# EAGLE design Driver-H-DC_V2_0 (EAGLE 5.11)
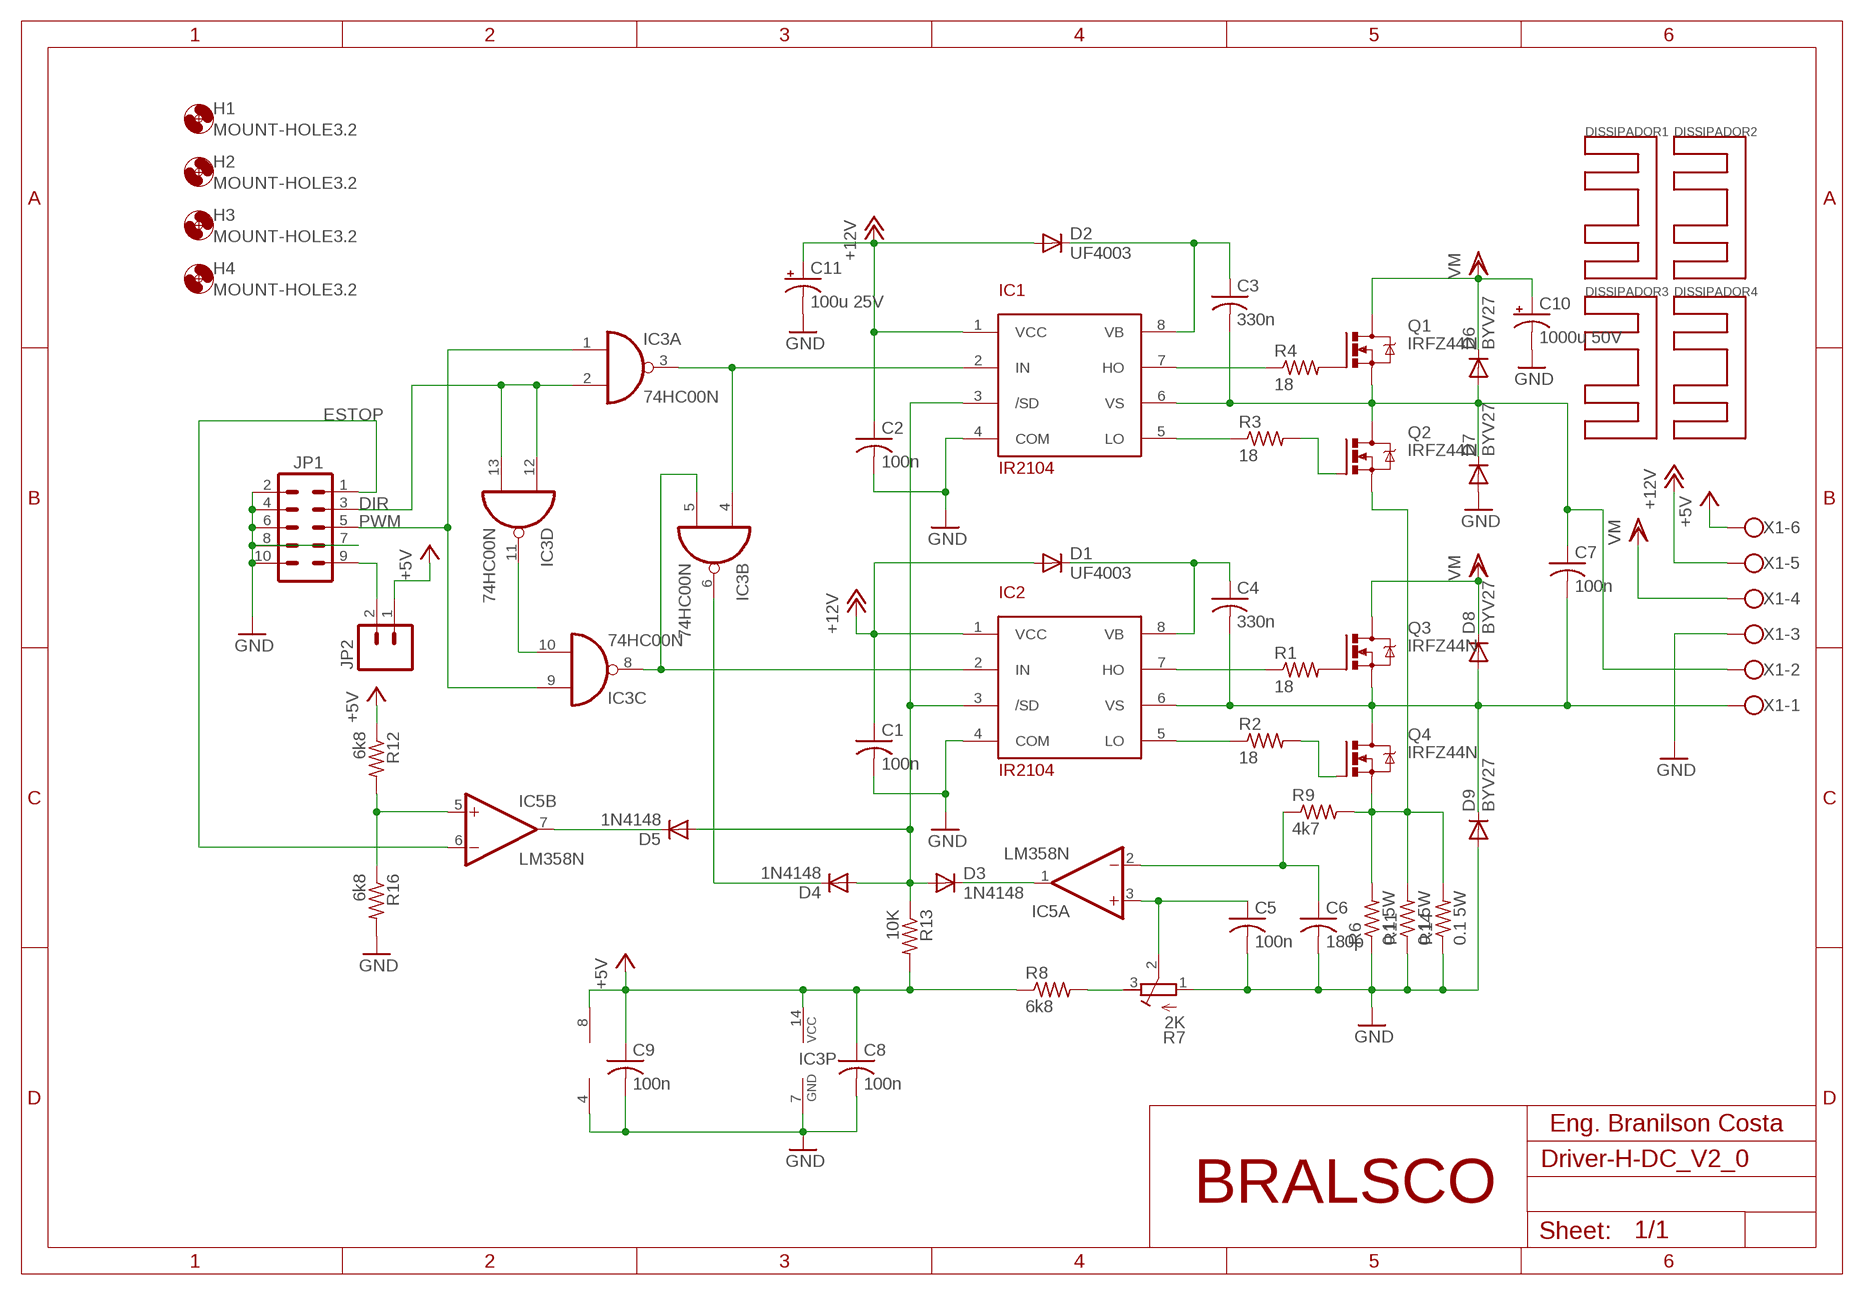
[diagram p0: schematic, sheet 1]

## Parts
C1  100n  C-US075-032X103  [C075-032X103]
C2  100n  C-US075-032X103  [C075-032X103]
C3  330n  C-US050-024X044  [C050-024X044]
C4  330n  C-US050-024X044  [C050-024X044]
C5  100n  C-US075-032X103  [C075-032X103]
C6  180p  C-US075-032X103  [C075-032X103]
C7  100n  C-US050-024X044  [C050-024X044]
C8  100n  C-US050-024X044  [C050-024X044]
C9  100n  C-US075-032X103  [C075-032X103]
C10  1000u 50V  CPOL-USE7.5-16  [E7,5-16]
C11  100u 25V  CPOL-USE5-8.5  [E5-8,5]
D1  UF4003  [DO41-10]
D2  UF4003  [DO41-10]
D3  1N4148  1N4148DO35-10  [DO35-10]
D4  1N4148  1N4148DO35-10  [DO35-10]
D5  1N4148  1N4148DO35-10  [DO35-10]
D6  BYV27  [SOD57-10]
D7  BYV27  [SOD57-10]
D8  BYV27  [SOD57-10]
D9  BYV27  [SOD57-10]
DISSIPADOR1  D_TO220_ALET  [DTO220ALET]
DISSIPADOR2  D_TO220_ALET  [DTO220ALET]
DISSIPADOR3  D_TO220_ALET  [DTO220ALET]
DISSIPADOR4  D_TO220_ALET  [DTO220ALET]
H1  MOUNT-HOLE3.2  [3,2]
H2  MOUNT-HOLE3.2  [3,2]
H3  MOUNT-HOLE3.2  [3,2]
H4  MOUNT-HOLE3.2  [3,2]
IC1  IR2104  [DIL08]
IC2  IR2104  [DIL08]
IC3  74HC00N  [DIL14]
IC5  LM358N  [DIL08]
JP1  M05X2SHD  [2X5-SHROUDED]
JP2  M02  [1X02_LONGPADS]
Q1  IRFZ44N  IRF540  [TO220BV]
Q2  IRFZ44N  IRF540  [TO220BV]
Q3  IRFZ44N  IRF540  [TO220BV]
Q4  IRFZ44N  IRF540  [TO220BV]
R1  18  R-US_0207/10  [0207/10]
R2  18  R-US_0207/10  [0207/10]
R3  18  R-US_0207/10  [0207/10]
R4  18  R-US_0207/10  [0207/10]
R6  0.1 5W  R-US_0617/17  [0617/17]
R7  2K  R-TRIMM3339P  [RTRIM3339P]
R8  6k8  R-US_0207/10  [0207/10]
R9  4k7  R-US_0207/10  [0207/10]
R11  0.1 5W  R-US_0617/17  [0617/17]
R12  6k8  R-US_0207/10  [0207/10]
R13  10K  R-US_0207/10  [0207/10]
R14  0.1 5W  R-US_0617/17  [0617/17]
R16  6k8  R-US_0207/10  [0207/10]
X1  W237-136  [W237-136]

## Nets
+5V: C8.1 C9.1 IC3.14(P:VCC) IC5.8(P:V+) JP2.1 R8.1 R12.1 R13.2 X1.6
+12V: C1.1 C2.1 C11.+ D1.A D2.A IC1.1(VCC) IC2.1(VCC) X1.5
DIR: IC3.2(A:I1) IC3.12(D:I0) IC3.13(D:I1) JP1.3
ESTOP: IC5.6(B:-IN) JP1.1
GND: C1.2 C2.2 C5.2 C6.2 C8.2 C9.2 C10.- C11.- D7.A D9.A IC1.4(COM) IC2.4(COM) IC3.7(P:GND) IC5.4(P:V-) JP1.2 JP1.4 JP1.6 JP1.7 JP1.8 JP1.10 R6.1 R7.1(E) R11.1 R14.1 R16.2 X1.3
N$1: C4.1 D1.C IC2.8(VB)
N$2: C4.2 C7.2 D8.A D9.C IC2.6(VS) Q3.S Q4.D X1.1
N$3: IC1.2(IN) IC3.3(A:O) IC3.4(B:I0)
N$4: IC2.7(HO) R1.1
N$5: IC1.5(LO) R3.1
N$6: Q3.G R1.2
N$7: IC2.5(LO) R2.1
N$8: Q4.G R2.2
N$9: C3.1 D2.C IC1.8(VB)
N$10: Q2.G R3.2
N$11: IC1.7(HO) R4.1
N$12: Q1.G R4.2
N$13: C3.2 C7.1 D6.A D7.C IC1.6(VS) Q1.S Q2.D X1.2
N$14: D3.A D4.A D5.A IC1.3(/SD) IC2.3(/SD) R13.1
N$16: IC3.10(C:I1) IC3.11(D:O)
N$17: Q2.S Q4.S R6.2 R9.2 R11.2 R14.2
N$18: D3.C IC5.1(A:OUT)
N$19: C5.1 IC5.3(A:+IN) R7.2(S)
N$20: R7.3(A) R8.2
N$21: C6.1 IC5.2(A:-IN) R9.1
N$22: D4.C IC3.6(B:O)
N$23: IC2.2(IN) IC3.5(B:I1) IC3.8(C:O)
N$24: JP1.9 JP2.2
N$25: D5.C IC5.7(B:OUT)
N$28: IC5.5(B:+IN) R12.2 R16.1
PWM: IC3.1(A:I0) IC3.9(C:I0) JP1.5
VDD: C10.+ D6.C D8.C Q1.D Q3.D X1.4 ; supply symbol labelled VM

## Notes on the sheet
- Eng. Branilson Costa
- BRALSCO

## Library data of the parts
C1 C2 C5 C6 C9 = rcl:C-US: CAPACITOR, American symbol
C3 C4 C7 C8 = resistor:C-US: CAPACITOR, American symbol
C10 C11 = rcl:CPOL-US: POLARIZED CAPACITOR, American symbol
D1 D2 = diode:UF4003: DIODE ultrafast recovery diode, 200 V rectifier
D3-D5 = diode:1N4148: DIODE high speed (Philips)
D6-D9 = diode:BYV27: DIODE ultra fast
DISSIPADOR1-DISSIPADOR4 = BL:D_TO220_ALET: Dissipador aletado para componentes em encapsulamento TO220 Dimenssões: 28 x 16mm Grid: 0,7"
H1-H4 = holes:MOUNT-HOLE: MOUNTING HOLE with drill center marker
IC1 IC2 = BL:IR2104
IC3 = 74xx-eu:74*00: Quad 2-input NAND gate
IC5 = linear:LM358: OP AMP also LM158; LM258; LM2904 Source: http://cache.national.com/ds/LM/LM158.pdf
JP1 = SparkFun:M05X2: Header 5x2 Standard 10-pin dual row 0.1" header. Commonly used with AVR-ISP. Use with Spark Fun Electronics SKU: PRT-00778
JP2 = SparkFun:M02: Header 2 Standard 2-pin 0.1" header. Use with straight break away headers (SKU : PRT-00116), right angle break away headers (PRT-00553), swiss pins (PRT-00743), machine pins (PRT-00117), and female headers (PRT-00115). Molex polarized connector foot print use with SKU : PRT-08233 with associated crimp pins and housings.
Q1-Q4 = transistor-power:IRF540: HEXFET Power MOSFET
R1-R4 R6 R8 R9 R11-R14 R16 = resistor:R-US_: RESISTOR, American symbol
R7 = resistor:R-TRIMM: Trimm resistor
X1 = con-wago-500:W237-136: WAGO SCREW CLAMP; MPN: 237-136; OC_FARNELL: unknown; OC_NEWARK: 84K9151

## Board
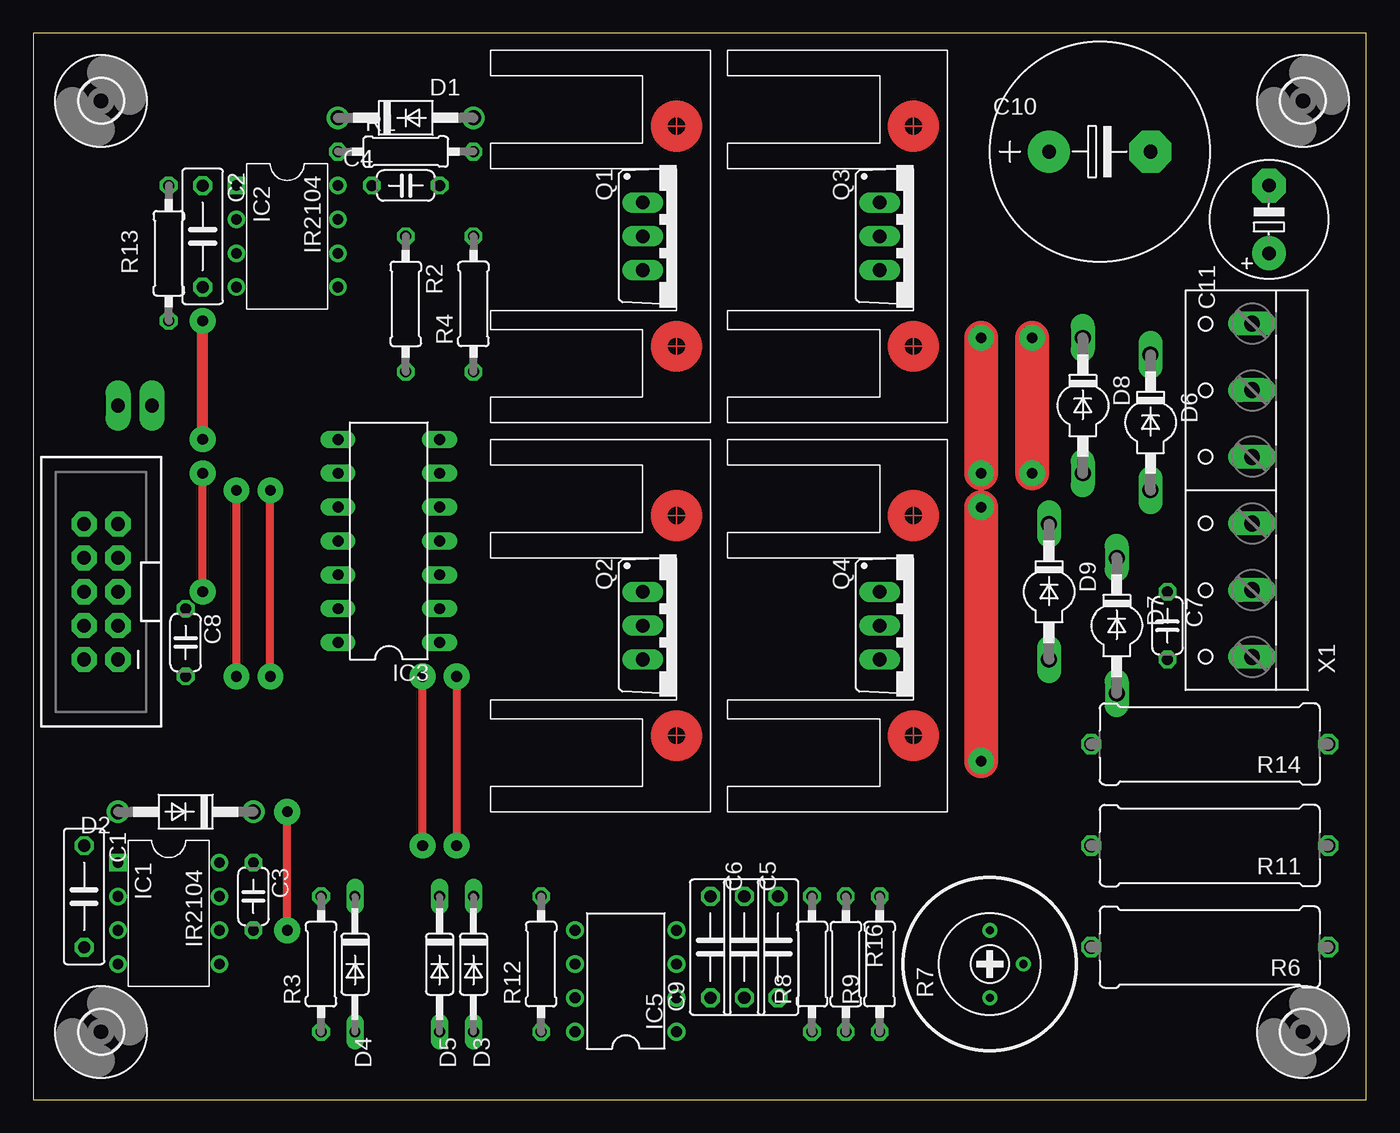
[diagram p1: board, top side]
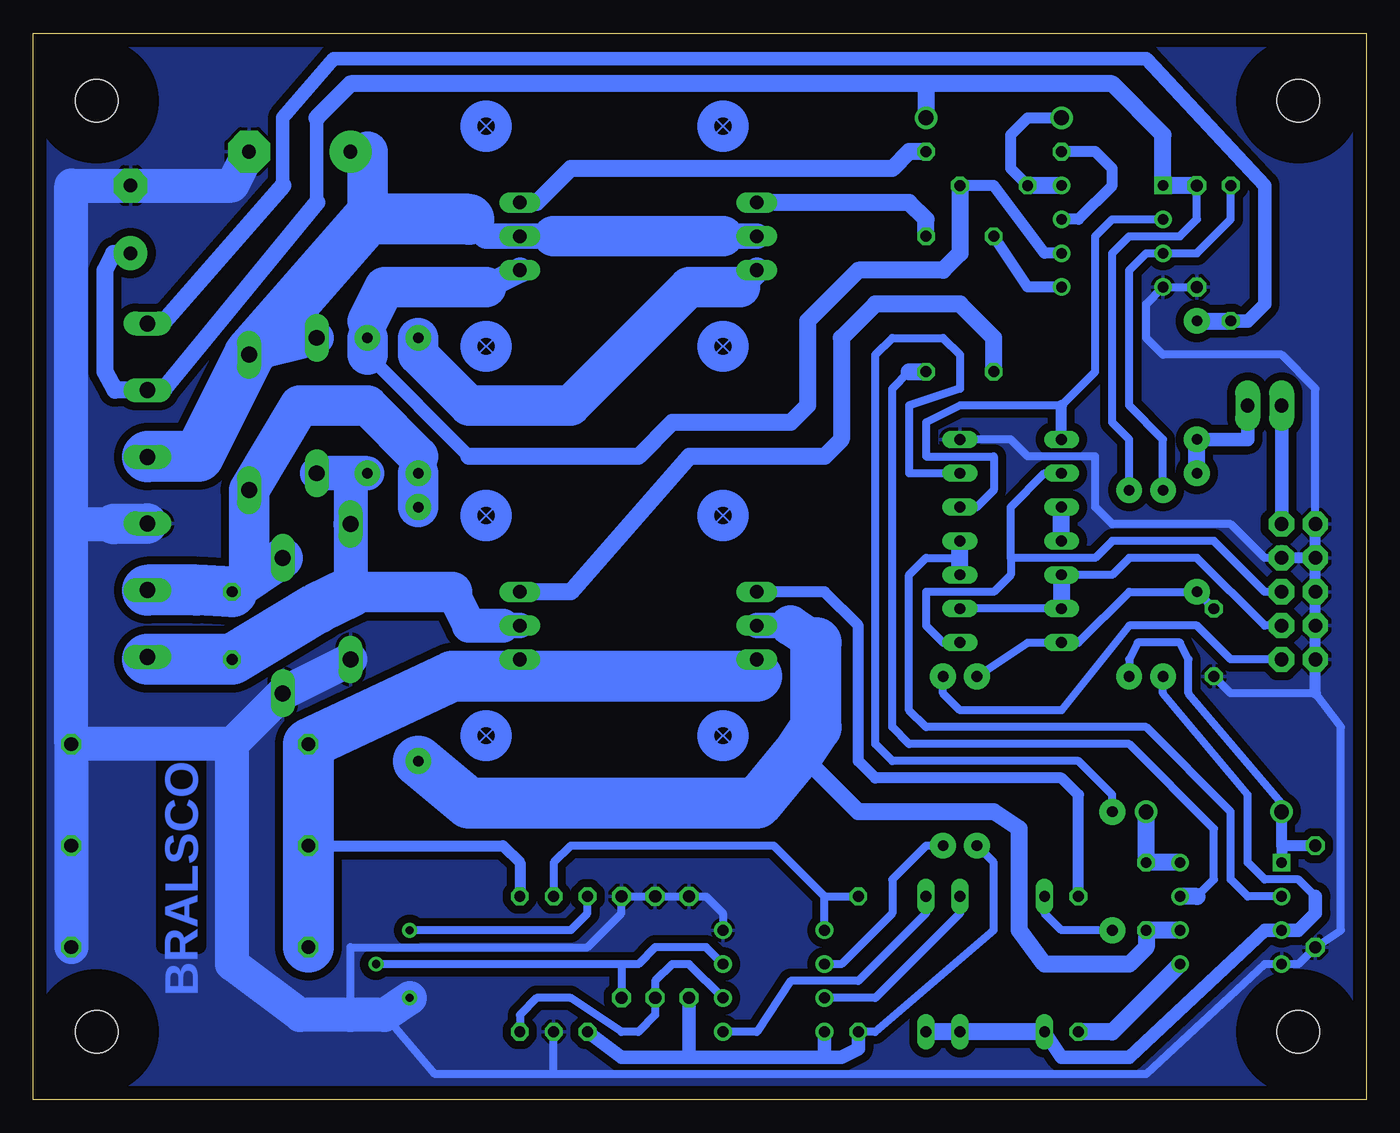
[diagram p2: board, bottom side, seen from below]

Size 100 x 80 mm. Coordinates in mm from the lower left corner, seen from the top.
Outline: 0,0 100,0 100,80 0,80 0,0
Copper layers (1*16): Top 0.035mm / dielectric 1.5mm / Bottom 0.035mm
Design rules "default *": minimum track width 23mil, minimum drill 24mil, track to track 12mil, track to pad 12mil, pad to pad 12mil, via to via 12mil, smd to smd 8mil, copper to edge 40mil, drill to drill 8mil, minimum pad ring 10mil, minimum via ring 10mil, stop-mask expansion 4mil, vias tented up to drill 0mil, thermal gap 10mil

### Footprints (pad centres in the part's own frame; a part is rotated, then mirrored left to right if it is on the bottom)
C075-032X103 = drill 0.914 octagon: 1 -3.81,0; 2 3.81,0
C050-024X044 = drill 0.813 octagon: 1 -2.54,0; 2 2.54,0
E7,5-16 = drill 1.016 pad 3.15 round: + -3.81,0 | drill 1.016 pad 3.15 octagon: - 3.81,0
E5-8,5 = drill 1.016 pad 2.54 round: + -2.54,0 | drill 1.016 pad 2.54 octagon: - 2.54,0
DO41-10 = drill 1.118 round: A 5.08,0; C -5.08,0
DO35-10 = drill 0.813 long: A 5.08,0; C -5.08,0
SOD57-10 = drill 1.194 long: A 5.08,0; C -5.08,0
3,2 = hole 3.2: 0,0
DIL08 = drill 0.8 square: 1 -3.81,-3.81 | drill 0.8 round: 2 -1.27,-3.81; 3 1.27,-3.81; 4 3.81,-3.81; 5 3.81,3.81; 6 1.27,3.81; 7 -1.27,3.81; 8 -3.81,3.81
DIL14 = drill 0.813 long: 1 -7.62,-3.81; 2 -5.08,-3.81; 3 -2.54,-3.81; 4 0,-3.81; 5 2.54,-3.81; 6 5.08,-3.81; 7 7.62,-3.81; 8 7.62,3.81; 9 5.08,3.81; 10 2.54,3.81; 11 0,3.81; 12 -2.54,3.81; 13 -5.08,3.81; 14 -7.62,3.81
DIL08' = drill 0.813 pad 1.27 round: 1 -3.81,-3.81; 2 -1.27,-3.81; 3 1.27,-3.81; 4 3.81,-3.81; 5 3.81,3.81; 6 1.27,3.81; 7 -1.27,3.81; 8 -3.81,3.81
2X5-SHROUDED = drill 1.016 pad 1.88 octagon: 1 -1.27,5.08; 2 1.27,5.08; 3 -1.27,2.54; 4 1.27,2.54; 5 -1.27,0; 6 1.27,0; 7 -1.27,-2.54; 8 1.27,-2.54; 9 -1.27,-5.08; 10 1.27,-5.08
1X02_LONGPADS = drill 1.016 pad 1.88 long: 1 0,0; 2 2.54,0
TO220BV = drill 1.016 long: D 0,-2.54; G -2.54,-2.54; S 2.54,-2.54
0207/10 = drill 0.813 octagon: 1 -5.08,0; 2 5.08,0
0617/17 = drill 1.016 octagon: 1 -8.89,0; 2 8.89,0
RTRIM3339P = drill 0.61 round: 1 -2.54,0; 2 0,-2.54; 3 2.54,0
W237-136 = drill 1.194 long: 1 -12.5,-1.27; 2 -7.5,-1.27; 3 -2.5,-1.27; 4 2.5,-1.27; 5 7.5,-1.27; 6 12.5,-1.27

### Placement (x,y rotation side)
C1  3.81,15.24 270 top
C2  12.7,64.77 270 top
C3  16.51,15.24 270 top
C4  27.94,68.58 0 top
C5  55.88,11.43 90 top
C6  53.34,11.43 90 top
C7  85.09,35.56 270 top
C8  11.43,34.29 270 top
C9  50.8,11.43 90 top
C10  80.01,71.12 0 top
C11  92.71,66.04 90 top
D1  27.94,73.66 0 top
D2  11.43,21.59 180 top
D3  33.02,10.16 270 top
D4  24.13,10.16 270 top
D5  30.48,10.16 270 top
D6  83.82,50.8 270 top
D7  81.28,35.56 270 top
D8  78.74,52.07 270 top
D9  76.2,38.1 270 top
DISSIPADOR1  66.04,64.77 0 top
DISSIPADOR2  66.04,35.56 0 top
DISSIPADOR3  48.26,64.77 0 top
DISSIPADOR4  48.26,35.56 0 top
H1  5.08,5.08 0 top
H2  95.25,5.08 0 top
H3  95.25,74.93 0 top
H4  5.08,74.93 0 top
IC1  10.16,13.97 270 top
IC2  19.05,64.77 270 top
IC3  26.67,41.91 90 top
IC5  LM358N  [DIL08']  44.45,8.89 90 top
JP1  5.08,38.1 180 top
JP2  8.89,52.07 180 top
Q1  48.26,64.77 270 top
Q2  48.26,35.56 270 top
Q3  66.04,64.77 270 top
Q4  66.04,35.56 270 top
R1  27.94,71.12 0 top
R2  27.94,59.69 270 top
R3  21.59,10.16 90 top
R4  33.02,59.69 90 top
R6  88.27,11.43 180 top
R7  71.75,10.16 90 top
R8  58.42,10.16 90 top
R9  63.5,10.16 90 top
R11  88.27,19.05 180 top
R12  38.1,10.16 90 top
R13  10.16,63.5 270 top
R14  88.27,26.67 180 top
R16  60.96,10.16 270 top
X1  90.17,45.72 90 top

### Tracks (layer width: path | path; a pad name or v marks a point on that pad's centre or on a via)
+5V  (via drill 0.8 pad 1.93)
  Top 0.61: v29.21,19.05 v29.21,31.75 | v12.7,38.1 v12.7,46.99
  Top 0.813: v12.7,49.53 v12.7,58.42
  Bottom 0.61: R12.1 36.83,5.08 27.94,12.7 27.94,17.78 v29.21,19.05 | v29.21,31.75 25.4,34.29 IC3.14 21.59,34.29 17.78,38.1 v12.7,38.1 C8.1
  Bottom 1.016: 90.17,58.42 X1.6 | 81.28,68.58 81.28,73.66 77.47,78.11 16.51,78.11 7.62,68.58 7.62,59.69 8.89,58.42 R13.2 | JP2.1 8.89,49.53 v12.7,49.53 | 40.64,3.17 39.37,3.17 38.1,3.81 R12.1 | 40.64,3.17 IC5.8 | 40.64,3.17 50.8,3.17 | 50.8,3.17 55.88,3.17 R8.1 | 50.8,3.17 C9.1
  Bottom 1.27: 81.28,68.58 90.17,58.42 | v12.7,58.42 R13.2 | v12.7,46.99 v12.7,49.53
+12V  (via drill 0.8 pad 1.93)
  Top 0.61: v17.78,31.75 v17.78,45.72
  Bottom 0.61: D2.A 6.35,22.23 13.34,30.48 13.34,33.02 13.97,34.29 17.14,34.29 17.78,33.02 v17.78,31.75 | C2.1 12.7,66.04 13.97,64.77 17.78,64.77 19.05,63.5 19.05,50.8 17.78,49.53 v17.78,45.72
  Bottom 0.813: C1.1 6.35,19.05 | 6.35,19.05 D2.A | 6.35,19.05 IC1.1
  Bottom 1.016: 90.17,53.34 90.29,53.22 | 78.74,73.66 78.74,67.31
  Bottom 1.27: C11.+ 93.98,63.5 94.61,62.23 94.61,54.61 93.86,53.22 X1.5 90.29,53.22 | 78.74,67.31 90.17,53.34 | 78.74,73.66 76.2,76.2 33.02,76.2 | 33.02,76.2 D1.A | 33.02,76.2 19.05,76.2 15.24,72.39 IC2.1 C2.1
DIR
  Bottom 0.61: JP1.3 7.62,35.56 12.7,40.64 17.78,40.64 19.05,39.37 IC3.12 | IC3.13 IC3.2
  Bottom 1.27: IC3.12 IC3.13
ESTOP  (via drill 0.8 pad 1.93)
  Top 0.61: v31.75,31.75 v31.75,19.05
  Bottom 0.61: JP1.1 10.16,33.02 12.7,35.56 17.78,35.56 22.86,29.21 30.48,29.21 31.75,30.48 v31.75,31.75 | IC5.6 39.37,10.16 35.56,13.97 35.56,16.51 33.02,19.05 v31.75,19.05
GND
  Bottom 0.61: C8.2 10.16,30.48 3.81,30.48 1.91,27.94 1.91,12.7 C1.2 5.08,10.16 IC1.4 7.62,10.16 16.51,1.91 60.96,1.91 | 73.66,6.35 69.85,1.91 60.96,1.91 | 60.96,1.91 R16.2 | C2.2 IC2.4 16.51,59.69 16.51,57.15 15.24,55.88 6.35,55.88 3.81,53.34 JP1.10 | C9.2 C6.2 C5.2 | C5.2 C9.2 | C9.2 49.53,15.24 48.26,13.97 IC5.4 | C5.2 55.88,13.97 58.42,11.43 76.2,11.43 76.2,6.35 | IC3.7 26.67,49.53 25.4,48.26 20.32,48.26 20.32,44.45 19.05,43.18 10.16,43.18 7.62,40.64 JP1.7
  Bottom 0.813: JP1.8 JP1.10 | JP1.8 JP1.6 JP1.4 JP1.2 3.81,30.48 | JP1.8 JP1.7
  Bottom 2.54: C10.- 85.09,68.58 C11.- 97.16,68.58 97.16,43.18 | 97.16,43.18 93.98,43.18 | R14.1 97.16,43.18 | R14.1 R11.1 R6.1 | D9.A D7.A 85.09,26.67 | 85.09,26.67 R14.1 | 85.09,26.67 85.09,10.16 80.01,6.35 76.2,6.35 73.66,6.35 R7.1
  Bottom 3.048: 93.98,43.18 X1.3
  pour Bottom (isolate 0.61): 0,80.01 0,0 100.33,0 100.33,78.74 99.06,80.01
N$1
  Bottom 0.813: D1.C 25.4,73.66 26.67,72.39 26.67,69.85 C4.1
  Bottom 1.27: IC2.8 C4.1
N$2  (via drill 0.8 pad 1.93)
  Top 2.54: v74.93,57.15 v74.93,46.99
  Bottom 0.813: IC2.6 24.13,63.5 27.94,68.58 C4.2
  Bottom 1.016: 67.31,48.26 74.93,55.88
  Bottom 1.27: C4.2 30.48,63.5 31.75,62.23 38.1,62.23 41.91,58.42 41.91,52.07 43.18,50.8 52.07,50.8 54.61,48.26 67.31,48.26
  Bottom 1.93: 64.77,35.56 Q4.D | 66.04,60.96 Q3.S
  Bottom 2.54: 91.44,33.02 X1.1 | 64.77,35.56 67.31,35.56 68.58,38.1 | 76.2,38.1 D9.C 76.2,46.99 D8.A v74.93,46.99 | v74.93,57.15 74.93,58.42
  Bottom 3.048: 76.2,38.1 68.58,38.1 | 74.93,58.42 73.66,60.96 66.04,60.96 | 74.93,55.88 v74.93,57.15
  Bottom 3.81: 91.44,33.02 C7.2 78.74,36.83 76.2,38.1
N$3
  Bottom 0.61: IC3.3 30.48,40.64 33.02,40.64 34.29,39.37 34.29,29.21 33.02,27.94 16.51,27.94 10.16,21.59 10.16,16.51 8.89,15.24 IC1.2
  Bottom 1.27: IC3.3 IC3.4
N$4
  Bottom 0.813: R1.1 20.32,71.12 19.05,69.85 19.05,68.58 21.59,66.04 IC2.7
N$5
  Bottom 1.27: IC1.5 19.05,5.08 R3.1
N$6
  Bottom 1.27: R1.2 34.29,71.12 35.56,69.85 59.69,69.85 62.23,67.31 Q3.G
N$7
  Bottom 0.813: IC2.5 25.4,60.96 R2.1
N$8
  Bottom 1.27: R2.2 27.94,57.15 30.48,59.69 36.83,59.69 39.37,57.15 39.37,49.53 40.64,48.26 50.8,48.26 59.69,38.1 Q4.G
N$9
  Bottom 1.27: IC1.8 C3.1 D2.C
N$10
  Bottom 0.813: R3.2 21.59,22.86 22.86,24.13 36.83,24.13 38.1,25.4 38.1,35.56 40.64,38.1 Q2.G
N$11
  Bottom 0.61: 12.7,15.24 11.43,16.51 11.43,20.32 17.78,26.67 34.29,26.67 35.56,27.94 35.56,53.34 34.29,54.61
  Bottom 1.27: 12.7,15.24 IC1.7 | 34.29,54.61 R4.1
N$12
  Bottom 1.27: R4.2 33.02,66.04 34.29,67.31 Q1.G
N$13  (via drill 0.8 pad 1.93)
  Top 2.54: v71.12,25.4 v71.12,44.45 | v71.12,46.99 v71.12,57.15
  Bottom 1.27: IC1.6 C3.2 16.51,11.43 17.78,10.16 24.13,10.16 26.04,12.7 26.04,20.32 27.94,21.59 38.1,21.59 42.55,26.04
  Bottom 1.93: 46.99,60.96 Q1.S | 43.18,35.56 Q2.D
  Bottom 2.54: v71.12,46.99 71.12,48.26
  Bottom 3.048: D7.C C7.1 83.82,39.37 D6.A 80.01,52.07 74.93,52.07 71.12,48.26 | 41.27,34.29 43.18,35.56 | v71.12,44.45 v71.12,46.99 | v71.12,57.15 71.12,55.88 67.31,52.07 59.69,52.07 50.8,60.96 46.99,60.96
  Bottom 3.81: X1.2 87.75,38.22 C7.1 | 41.27,34.29 41.27,27.94 42.55,26.04 45.72,22.23 67.31,22.23 v71.12,25.4
N$14  (via drill 0.8 pad 1.93)
  Top 0.61: v15.24,31.75 v15.24,45.72
  Bottom 0.61: R13.1 10.16,66.04 12.7,63.5 IC2.3 16.51,63.5 17.78,62.23 17.78,52.07 15.24,49.53 v15.24,45.72 | 3.81,15.24 5.08,16.51 7.62,16.51 8.89,17.78 8.89,22.86 15.24,30.48 v15.24,31.75
  Bottom 1.016: D4.A 22.86,3.17 17.78,3.17 7.62,12.7 IC1.3 5.08,12.7 3.81,13.97 3.81,15.24
  Bottom 1.27: D3.A D5.A D4.A
N$16
  Bottom 1.27: IC3.11 IC3.10
N$17
  Bottom 0.813: R11.2 64.77,19.05 63.5,17.78 R9.2
  Bottom 1.27: 45.72,31.75 Q2.S | 63.5,31.75 Q4.S
  Bottom 3.81: 45.72,31.75 63.5,31.75 68.58,31.75 R14.2 R11.2 R6.2
N$18
  Bottom 0.61: D3.C 33.02,13.97 38.1,8.89 43.18,8.89 45.72,5.08 IC5.1
N$19
  Bottom 0.61: 55.88,10.16 R7.2 | IC5.3 49.53,11.43 53.34,11.43 54.61,10.16 55.88,10.16 | 55.88,10.16 C5.1
N$20
  Bottom 0.61: R8.2 58.42,13.97 59.69,12.7 R7.3
N$21
  Bottom 0.61: R9.1 63.5,6.35 62.23,7.62 59.69,7.62 55.88,5.08 54.61,5.08 53.34,6.35 C6.1 53.34,8.89 52.07,10.16 50.8,10.16 IC5.2
N$22  (via drill 0.8 pad 1.93)
  Top 0.61: v19.05,12.7 v19.05,21.59
  Bottom 0.61: IC3.6 34.29,46.99 34.29,52.07 30.48,53.34 30.48,55.88 31.75,57.15 35.56,57.15 36.83,55.88 36.83,26.67 35.56,25.4 21.59,25.4 19.05,22.86 v19.05,21.59 | D4.C 24.13,13.97 22.86,12.7 v19.05,12.7
N$23
  Bottom 0.61: IC2.2 19.05,66.04 20.32,64.77 20.32,54.61 22.86,52.07 30.48,52.07 33.02,50.8 33.02,48.26 27.94,48.26 27.94,45.72 29.21,44.45 IC3.5
  Bottom 0.813: IC3.8 22.86,52.07
N$24
  Bottom 1.016: JP1.9 6.35,49.53 JP2.2
N$25
  Bottom 0.61: D5.C 30.48,13.97 36.83,7.62 IC5.7
N$28
  Bottom 0.61: IC5.5 40.64,15.24 | 40.64,15.24 R12.2 | 40.64,15.24 44.45,19.05 59.69,19.05 60.96,17.78 R16.1
PWM
  Bottom 0.61: IC3.1 31.75,34.29 33.02,35.56 33.02,38.1 27.94,38.1 26.67,39.37 26.67,40.64 | JP1.5 7.62,38.1 11.43,41.91 19.05,41.91 20.32,40.64 26.67,40.64 | IC3.9 24.13,46.99 26.67,44.45 26.67,40.64
VDD
  Bottom 1.93: 67.31,66.04 66.04,64.77 Q3.D 60.96,64.77 | Q1.D 48.26,64.77
  Bottom 2.54: 74.93,71.12 C10.+ | D6.C D8.C
  Bottom 3.048: 74.93,66.04 74.93,71.12 | 48.26,64.77 60.96,64.77
  Bottom 3.81: X1.4 91.4,48.26 87.63,48.26 D6.C 74.93,66.04 67.31,66.04

### Text on the board
Bottom: BRALSCO